# Altium schematic sheet Sheet1.SchDoc
size A; SheetNumber: 1; SheetTotal: 1
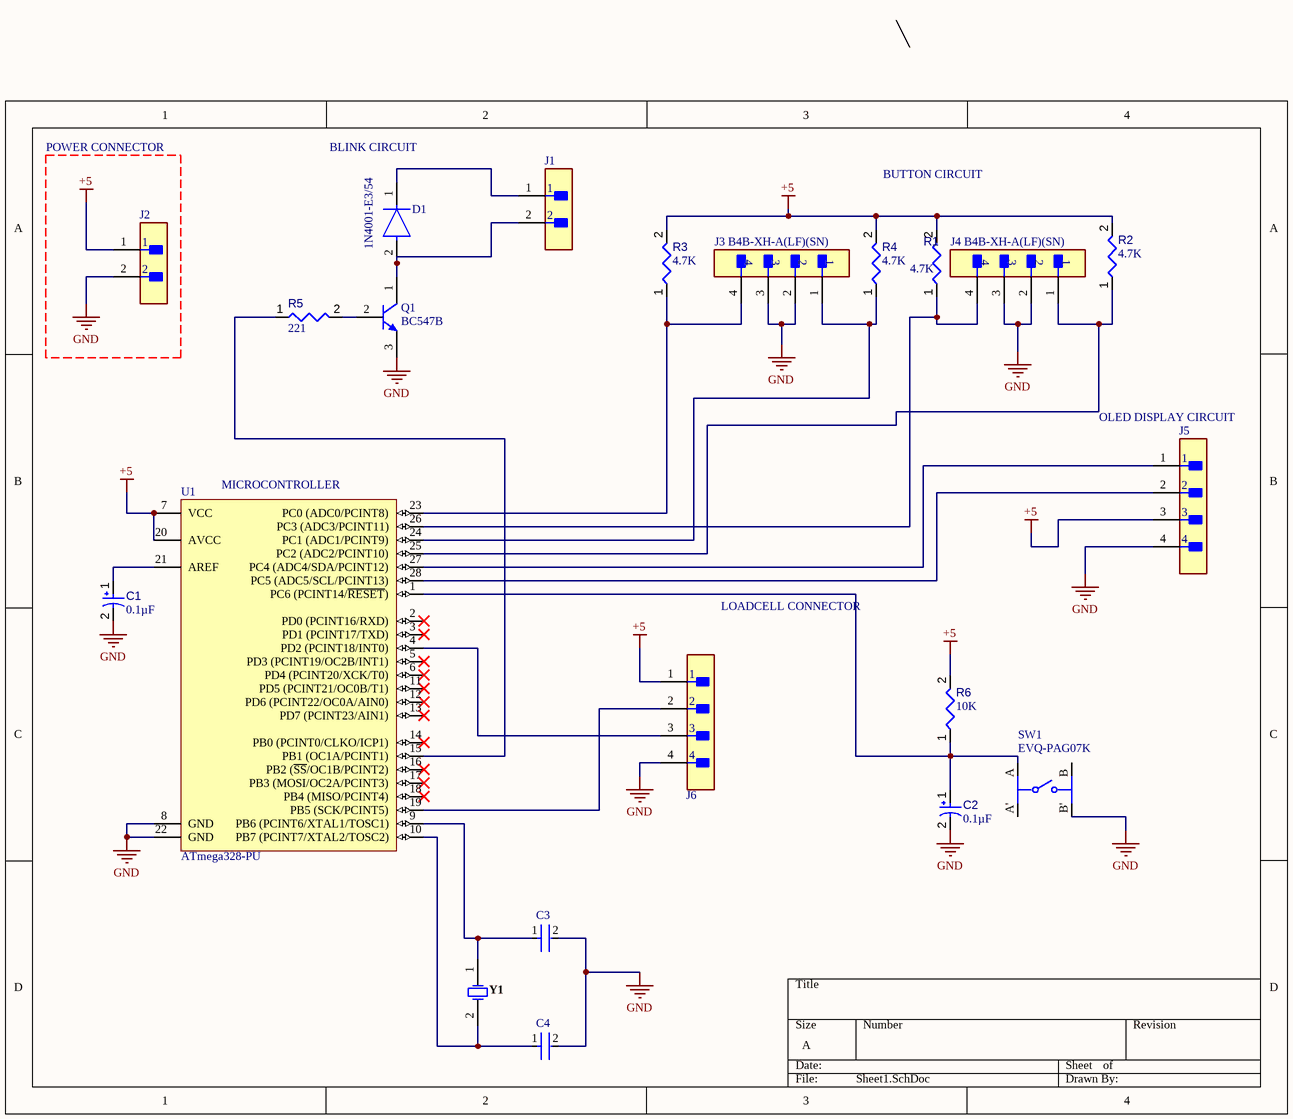
[diagram p0: Sheet1.SchDoc]

## Parts
C1  value 0.1µF  [CAPPR55-200-1100X500X1200]  (hidden comment: ECA-1HHG010)
C2  value 0.1µF  [CAPPR55-200-1100X500X1200]  (hidden comment: ECA-1HHG010)
C3  RCE5C1H220J0M1H03A  [FP-RCE0K1-MFG]  (value not drawn)
C4  RCE5C1H220J0M1H03A  [FP-RCE0K1-MFG]  (value not drawn)
D1  1N4001-E3/54  [FP-1N4001-E3-54-MFG]
J1  (no value)  [FP-B2B-XH-A_LF_SN-MFG]
J2  (no value)  [FP-B2B-XH-A_LF_SN-MFG]
J3  B4B-XH-A(LF)(SN)  [FP-B4B-XH-A_LF_SN-MFG]
J4  B4B-XH-A(LF)(SN)  [FP-B4B-XH-A_LF_SN-MFG]
J5  B4B-XH-A(LF)(SN)  [FP-B4B-XH-A_LF_SN-MFG]  (value not drawn)
J6  B4B-XH-A(LF)(SN)  [FP-B4B-XH-A_LF_SN-MFG]  (value not drawn)
Q1  BC547B  [ONSC-TO-92-3-29-11]
R1  value 4.7K  [RESA60-630X240]  (hidden comment: MFR-25FBF52-22R1)
R2  value 4.7K  [RESA60-630X240]  (hidden comment: MFR-25FBF52-22R1)
R3  value 4.7K  [RESA60-630X240]  (hidden comment: MFR-25FBF52-22R1)
R4  value 4.7K  [RESA60-630X240]  (hidden comment: MFR-25FBF52-22R1)
R5  value 221  [RESA60-630X240]  (hidden comment: MFR-25FBF52-221R)
R6  value 10K  [RESA60-630X240]  (hidden comment: MFR-25FBF52-22R1)
SW1  EVQ-PAG07K  [FP-EVQ-PAG07K-MFG]
U1  ATmega328-PU  [28P3]
Y1  HC-49US 16.000MHZ  [JPY-HC-49US]  (value not drawn)

## Blocks framed on the sheet
POWER CONNECTOR: J2

## Nets
+5: J2.1 J5.3 J6.1 R1.2 R2.2 R3.2 R4.2 R6.2 U1.7(VCC) U1.20(AVCC)
GND: C1.2 C2.2 C3.2 C4.2 J2.2 J3.2 J3.3 J4.2 J4.3 J5.4 J6.4 Q1.3(E) SW1.B' U1.8(GND) U1.22(GND)
NetC1_1: C1.1 U1.21(AREF)
NetC2_1: C2.1 R6.1 SW1.A U1.1(PC6_(PCINT14/~{RESET}))
NetC3_1: C3.1 U1.9(PB6_(PCINT6/XTAL1/TOSC1)) Y1.1
NetC4_1: C4.1 U1.10(PB7_(PCINT7/XTAL2/TOSC2)) Y1.2
NetD1_1: D1.1(C) J1.1
NetD1_2: D1.2(A) J1.2 Q1.1(C)
NetJ3_1: J3.1 R4.1 U1.24(PC1_(ADC1/PCINT9))
NetJ3_4: J3.4 R3.1 U1.23(PC0_(ADC0/PCINT8))
NetJ4_1: J4.1 R2.1 U1.25(PC2_(ADC2/PCINT10))
NetJ4_4: J4.4 R1.1 U1.26(PC3_(ADC3/PCINT11))
NetJ5_1: J5.1 U1.27(PC4_(ADC4/SDA/PCINT12))
NetJ5_2: J5.2 U1.28(PC5_(ADC5/SCL/PCINT13))
NetJ6_2: J6.2 U1.19(PB5_(SCK/PCINT5))
NetJ6_3: J6.3 U1.4(PD2_(PCINT18/INT0))
NetQ1_2: Q1.2(B) R5.2
NetR5_1: R5.1 U1.15(PB1_(OC1A/PCINT1))

Not connected (* = marked no-connect by the designer): SW1 A' B; U1 2(PD0_(PCINT16/RXD))* 3(PD1_(PCINT17/TXD))* 5(PD3_(PCINT19/OC2B/INT1))* 6(PD4_(PCINT20/XCK/T0))* 11(PD5_(PCINT21/OC0B/T1))* 12(PD6_(PCINT22/OC0A/AIN0))* 13(PD7_(PCINT23/AIN1))* 14(PB0_(PCINT0/CLKO/ICP1))* 16(PB2_(~{SS}/OC1B/PCINT2))* 17(PB3_(MOSI/OC2A/PCINT3))* 18(PB4_(MISO/PCINT4))*

## Notes on the sheet
- BLINK CIRCUIT
- BUTTON CIRCUIT
- (near J5) OLED DISPLAY CIRCUIT
- (near U1) MICROCONTROLLER
- LOADCELL CONNECTOR

## Library data of the parts
C1 C2 = CMP-001-00024-7: Aluminum Electrolytic Capacitor, 1 uF, +/- 20%, 50 V, -55 to 105 degC, 2-Pin THD, RoHS, Bulk; Manufacturer: Panasonic; Voltage Rating: 50V; Ripple Current: 10mA; Packaging: Bulk; Package Quantity: 200; Tolerance: 20%; Min Operating Temperature: -55°C; Diameter: 5mm; Capacitor Type: Electrolytic; Datasheet Version: Mar-05; Ripple Current (AC): 10mA; Manufacturer URL: http://www.panasonic.com/; Case/Package: Radial; Mounting Technology: TH; Pins: 2; Package Reference: CAPPR55-200-1100X500X1200; Package Description: 2-Pin Radial Lead, Dia 5 mm, Height 12 mm; RoHS Compliant: True; Max Operating Temperature: 105°C; Lead Pitch: 2mm; Datasheet URL: https://datasheet.ciiva.com/7275/94060-7275472.pdf
C3 C4 = CMP-06035-004895-1: Cap Ceramic 22pF 50V C0G ±5% Radial 5mm +125°C Automotive Bulk; Lead/Base Style: Formed Leads; Lead Diameter: 0.5mm; Max Operating Temperature: 125°C; Termination: Radial; Package Quantity: 2000; Capacitance: 22pF; Dielectric: C0G; Height - Seated (Max): 0.138inch; Width: 0.098inch; Lead Pitch: 0.197inch; Tolerance: 5%; Resistor Type: Ceramic; Case/Package: Radial; Mount: Through Hole; Voltage Rating: 50V; Ratings: AEC-Q200; Min Operating Temperature: -55°C; Packaging: Tape and Reel; Voltage Rating (DC): 50V; Height: 3.5mm; Length: 0.142inch
D1 = CMP-02540-000077-1: DIODE GEN PURP 50V 1A DO204AL; Max Surge Current: 30A; Forward Voltage: 1.1V; Capacitance: 15pF; Peak Non-Repetitive Surge Current: 45A; Polarity: Standard; Max Reverse Current: 5uA; Element Configuration: Single; Length: 0.204inch; Diameter: 2.7mm; Mount: Through Hole; Package Quantity: 5500; Series: -; Radiation Hardening: No; Width: 2.7mm; Max Forward Surge Current (Ifsm): 30A; Average Rectified Current: 1A; Voltage: 50V; Current Rating: 1A; Height: 2.7mm; Forward Current: 1A; Lead Free: Lead Free; Min Operating Temperature: -50°C; Number of Pins: 2; RoHS Compliant: Yes; Packaging: Tape and Reel; Current: 1A; Max Reverse Voltage (DC): 50V; Output Current: 1A; Reverse Voltage: 50V; Case/Package: DO-204AL; Max Repetitive Reverse Voltage (Vrrm): 50V; Voltage Rating (DC): 50V; Max Operating Temperature: 150°C
J1 J2 = CMP-2000-05888-3: CONN HEADER VERT 2POS 2.5MM; Current Rating: 3A; Voltage Rating: 250V; Number of Contacts: 2; Contact Resistance: 20mR; Wire/Cable Gauge: 22AWG; Insulation Resistance: 1GR; Connector Type: Male Pin; Packaging: Bulk; Contact Material: Brass; Lead Free: Lead Free; Orientation: Straight; Contact Plating: Tin; Max Current Rating: 3A; Termination: Solder; Fastening Type: Detent; Depth: 5.75mm; Housing Material: Polyamide; REACH SVHC: No SVHC; Series: XH; Voltage Rating (AC): 250V; Number of Positions: 2; Color: Natural; Contact Type: Male Pin; Max Voltage Rating (DC): 250V; Pitch: 2.5mm; Lead Pitch: 2.5mm; Mount: Through Hole; Max Operating Temperature: 85°C; Length: 7.4mm; Max Voltage Rating (AC): 250V; Min Operating Temperature: -25°C; Number of Rows: 1; Housing Color: White
J3-J6 = CMP-17439-000250-1: CONN HEADER VERT 4POS 2.5MM; Number of Contacts: 4; Contact Resistance: 20mR; Voltage Rating: 250V; Max Current Rating: 3A; Gender: Male; Wire/Cable Gauge: 22AWG; Mated Stacking Heights: 9.8mm; Insulation Resistance: 1GR; Orientation: Straight; Contact Type: Male Pin; Contact Finish - Mating: TIN; Series: XH; Max Voltage Rating (AC): 250V; Lead Pitch: 2.5mm; Contact Shape: Square; Insulation Color: Natural; Termination: Solder; Lead Free: Lead Free; Voltage Rating (AC): 250V; Number of Rows: 1; Flammability Rating: UL94 V-0; Number of Positions: 4; Max Operating Temperature: 85°C; Package Quantity: 500; Mount: Through Hole; REACH SVHC: No SVHC; Connector Type: Header; Insulation Material: Nylon; Fastening Type: Detent; Min Operating Temperature: -25°C; Housing Color: White; Packaging: Bulk; Contact Plating: Tin; Contact Material: Brass; Max Voltage Rating (DC): 250V; Housing Material: Polyamide; Color: Natural; Material: Polyamide; Pitch: 2.5mm; Depth: 5.75mm; Current Rating: 3A; Length: 12.4mm
Q1 = CMP-1048-01467-1: Amplifier Transistor, NPN Silicon, 3-Pin TO-92, Bulk Box; Manufacturer: On Semiconductor; IC Continuous (A): 0.1; fT Min (MHz): 150; DatasheetVersion: Rev. 7; ComponentLink1URL: http://www.onsemi.com/; Polarity: NPN; RoHS: FALSE; ComponentLink1Description: Manufacturer URL; Packing: Bulk Box; PackageDescription: 3-Pin Transistor Outline, Body 4.825 x 3.685 mm, Pitch 1.27 mm; ComponentLink3URL: http://www.onsemi.cn/pub_link/Collateral/2N6426-D.PDF; ComponentLink2Description: Datasheet; PackageVersion: Rev. AM; PackageReference: TO-92-3-29-11_AM_SL; ComponentLink3Description: Package Specification; Mounting Technology: Through Hole; PartNumber: BC547B; ComponentLink2URL: http://www.onsemi.com/pub_link/Collateral/BC546-D.PDF
R1-R4 R6 = CMP-009-00053-4: Axial Resistor, 22.1 Ohm, +/- 1%, 250 mW, -55 to 155 degC, 2-Pin THD, RoHS, Bulk; Manufacturer: Yageo; Power: 250mW; Voltage Rating: 250V; Packaging: Bulk; Package Reference: MFR-25; Min Operating Temperature: -55°C; Mounting Technology: TH; Case/Package: Axial; Manufacturer URL: http://www.yageo.com/; Datasheet Version: Apr-13; Tolerance: 1%; Datasheet URL: http://www.yageo.com/documents/recent/Yageo%20LR_MFR_2013.pdf; RoHS Compliant: True; Package Description: 2-Pin Axial Lead, Dia 2.4 mm, Body Length 6.3 mm; Package Quantity: 200; Max Operating Temperature: 155°C
R5 = CMP-009-00051-4: Axial Resistor, 221 Ohm, +/- 1%, 250 mW, -55 to 155 degC, 2-Pin THD, RoHS, Bulk; Manufacturer: Yageo; Power: 250mW; Voltage Rating: 250V; Package Quantity: 200; Manufacturer URL: http://www.yageo.com/; Case/Package: Axial; Package Reference: MFR-25; RoHS Compliant: True; Mounting Technology: TH; Datasheet URL: http://www.yageo.com/documents/recent/Yageo%20LR_MFR_2013.pdf; Packaging: Bulk; Package Description: 2-Pin Axial Lead, Dia 2.4 mm, Body Length 6.3 mm; Max Operating Temperature: 155°C; Tolerance: 1%; Datasheet Version: Apr-13; Min Operating Temperature: -55°C
SW1 = CMP-05618-000034-1: SWITCH TACTILE SPST-NO 0.02A 15V; Contact Current Rating: 20mA; Switch Function: Off-Mom; Illumination Type: Non-Illuminated; Switch Travel: 0.25mm; Operating Force: 2.6N; Actuator Color: Black; Actuator Length: 3.1mm; Contact Resistance: 50mR; Throw Configuration: SPST; Electrical Life: 50000Cycles; Actuator Type: Standard; Mount: Through Hole; Package Quantity: 500; RoHS Compliant: Yes; Packaging: Bulk; Orientation: Straight; Current Rating: 20mA; Voltage Rating (DC): 15V; Series: EVQPA; Length: 6mm; Termination: PC Pin; Max Current Rating: 20mA; Min Operating Temperature: -20°C; Size: 6mm; Depth: 7.8mm; Max Operating Temperature: 70°C; Mechanical Life: 50000Cycles; Lead Free: Lead Free; Max Voltage Rating (DC): 15V; Radiation Hardening: No
U1 = CMP-0095-00015-2: 8-bit AVR Microcontroller, 32KB Flash, 1KB EEPROM, 2KB SRAM, 28-pin PDIP, Industrial Grade (-40°C to 85°C); ComponentLink3Description: ATmega48A/48PA/88A/88PA/168A/168PA/328/328P Summary; RevisionNote: DatasheetVersion updated. URLs added.; DatasheetVersion: revD, May-2011; ComponentLink1URL: http://www.atmel.com/; PackageVersion: revB, Sep-2001; PackageDescription: 28-lead (0.300"/7.62mm Wide) Plastic Dual Inline Package (PDIP); PackageReference: 28P3; ComponentLink1Description: Manufacturer URL; ComponentLink2Description: ATmega48A/48PA/88A/88PA/168A/168PA/328/328P Datasheet; ComponentLink3URL: http://www.atmel.com/dyn/resources/prod_documents/8271S.pdf; ComponentLink2URL: http://www.atmel.com/dyn/resources/prod_documents/8271.pdf
Y1 = CMP-003-00005-2: Crystal, 16 MHz, +/- 30 ppm, 18 pF, -20 to 70 degC, 2-Pin THD; Manufacturer: Jing peng yuan; Frequency: 16MHz; Package Reference: HC-49US; Case/Package: HC-49US; RoHS Compliant: Unknown; Mounting Technology: TH; Package Description: 2-Pin Throug Hole Device, Body 11.05 x 4.65 mm, Pitch 4.9 mm; Datasheet URL: https://statics3.seeedstudio.com/images/opl/datasheet/306010014.pdf; Datasheet Version: May-15